# EAGLE design mr_radar_platypus_seeed (EAGLE 5.11)
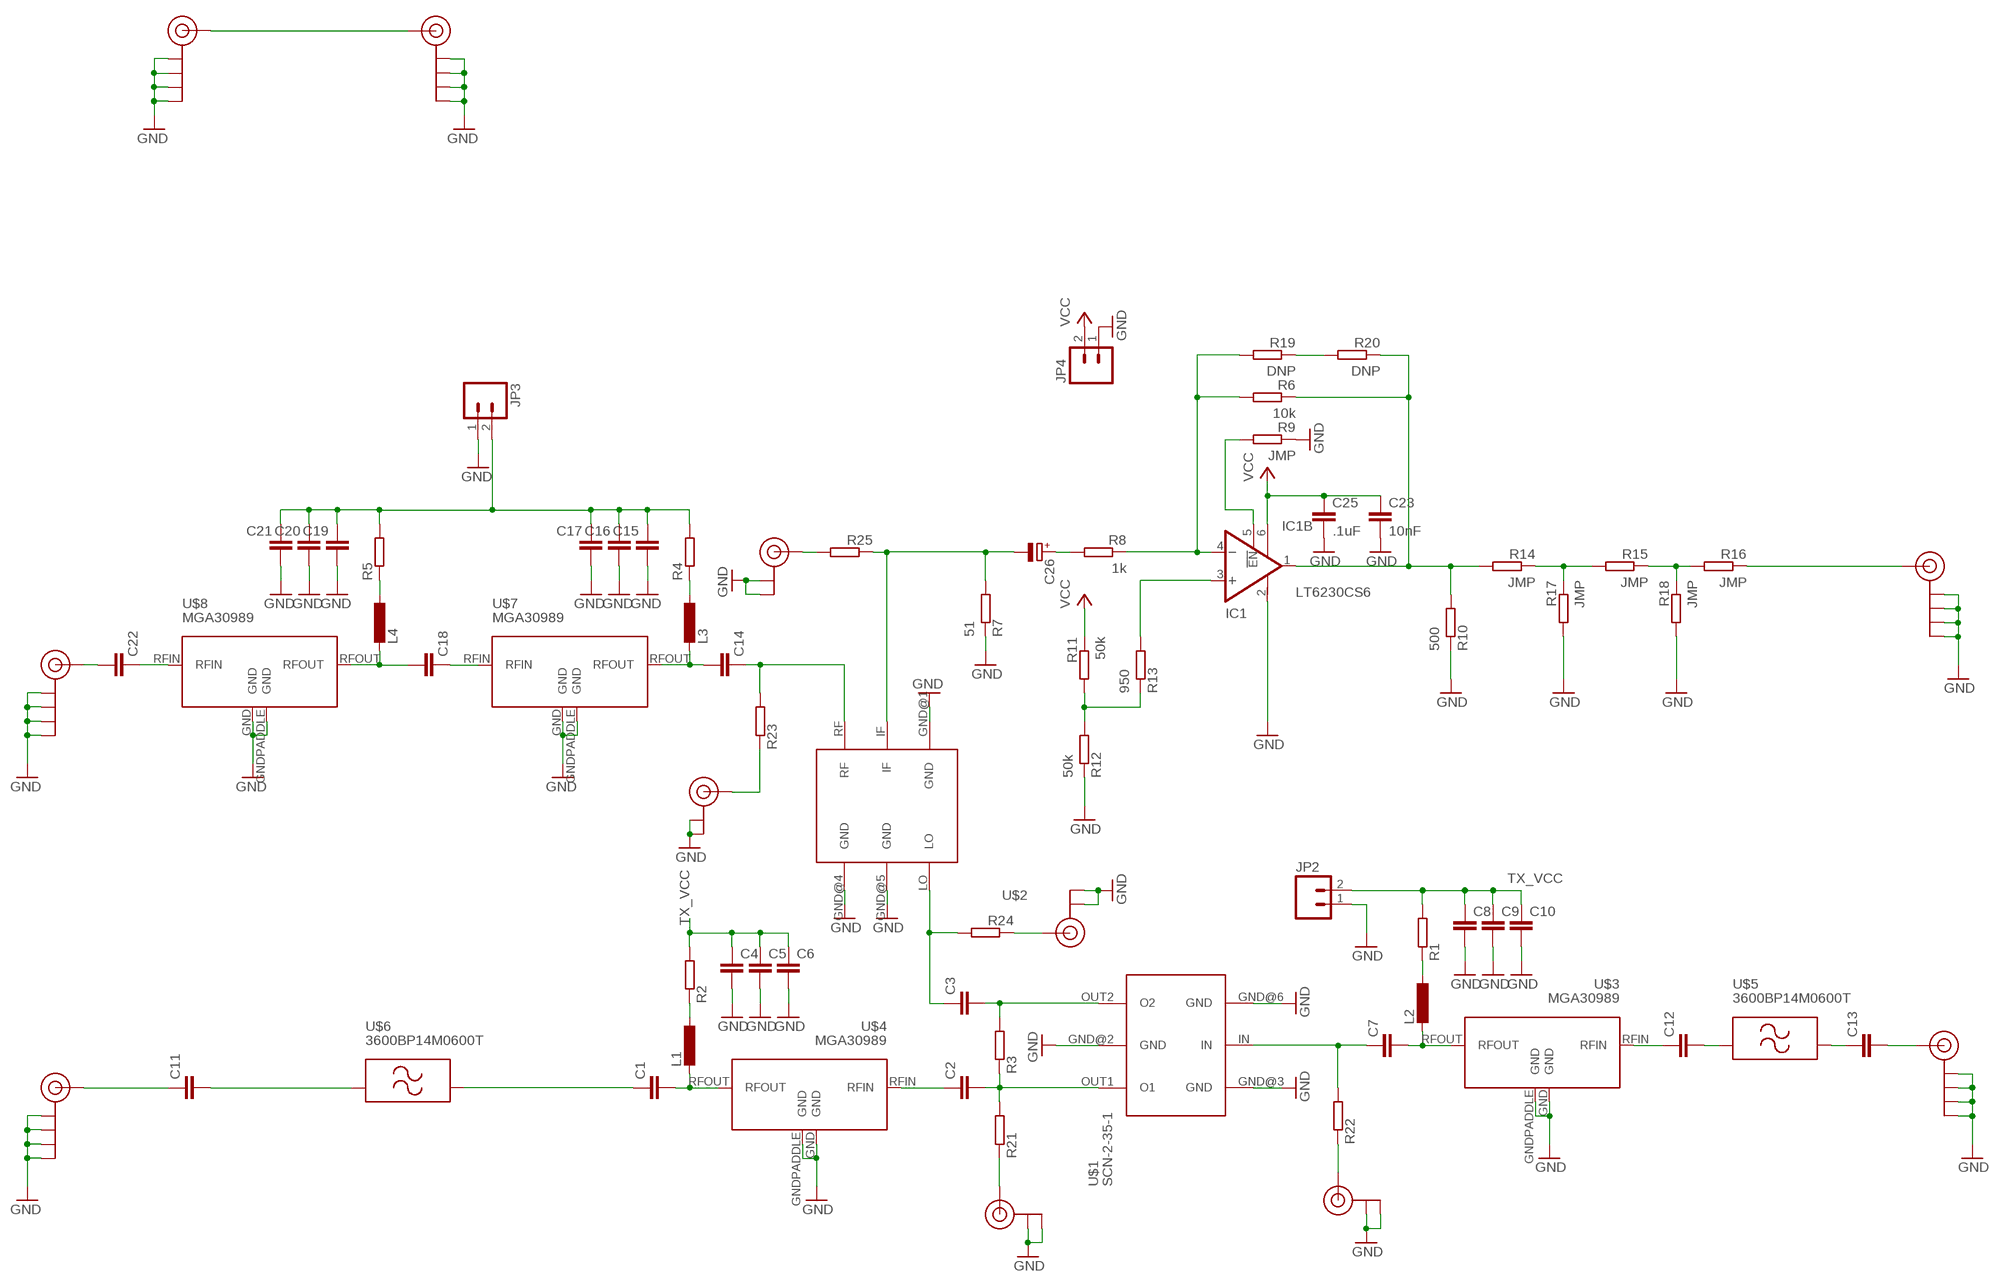
[diagram p0: schematic, sheet 1]

## Parts
C1  CAPACITOR-0402  [0402-CAP]
C2  CAPACITOR-0402  [0402-CAP]
C3  CAPACITOR-0402  [0402-CAP]
C4  CAPACITOR-0603  [0603-CAP]
C5  CAPACITOR-0603  [0603-CAP]
C6  CAPACITOR-0603  [0603-CAP]
C7  CAPACITOR-0402  [0402-CAP]
C8  CAPACITOR-0603  [0603-CAP]
C9  CAPACITOR-0603  [0603-CAP]
C10  CAPACITOR-0603  [0603-CAP]
C11  CAPACITOR-0402  [0402-CAP]
C12  CAPACITOR-0402  [0402-CAP]
C13  CAPACITOR-0402  [0402-CAP]
C14  CAPACITOR-0402  [0402-CAP]
C15  CAPACITOR-0402  [0402-CAP]
C16  CAPACITOR-0402  [0402-CAP]
C17  CAPACITOR-0402  [0402-CAP]
C18  CAPACITOR-0402  [0402-CAP]
C19  CAPACITOR-0402  [0402-CAP]
C20  CAPACITOR-0402  [0402-CAP]
C21  CAPACITOR-0402  [0402-CAP]
C22  CAPACITOR-0402  [0402-CAP]
C23  10nF  CAPACITOR-0603  [0603-CAP]
C25  .1uF  CAPACITOR-0603  [0603-CAP]
C26  CAPACITOR-POLD  [7343/D]
IC1  LT6230CS6  [TSOT23-6]
J$1  SMA_EDGE  [SMA-EDGE]
J$2  SMA_EDGE  [SMA-EDGE]
J$3  SMA_EDGE  [SMA-EDGE]
J$4  SMA_EDGE  [SMA-EDGE]
J$5  SMA_EDGE  [SMA-EDGE]
J$6  SMA_EDGE  [SMA-EDGE]
JP2  M02LOCK_LONGPADS  [1X02_LOCK_LONGPADS]
JP3  M02LOCK_LONGPADS  [1X02_LOCK_LONGPADS]
JP4  M02LOCK_LONGPADS  [1X02_LOCK_LONGPADS]
L1  INDUCTOR-0603  [0603-IND]
L2  INDUCTOR-0603  [0603-IND]
L3  INDUCTOR-0603  [0603-IND]
L4  INDUCTOR-0603  [0603-IND]
R1  RESISTOR-0603  [0603-RES]
R2  RESISTOR-0603  [0603-RES]
R3  RESISTOR-0603  [0603-RES]
R4  RESISTOR-0603  [0603-RES]
R5  RESISTOR-0603  [0603-RES]
R6  10k  RESISTOR-0603  [0603-RES]
R7  51  RESISTOR-0603  [0603-RES]
R8  1k  RESISTOR-0603  [0603-RES]
R9  JMP  RESISTOR-0603  [0603-RES]
R10  500  RESISTOR-0603  [0603-RES]
R11  50k  RESISTOR-0603  [0603-RES]
R12  50k  RESISTOR-0603  [0603-RES]
R13  950  RESISTOR-0603  [0603-RES]
R14  JMP  RESISTOR-0603  [0603-RES]
R15  JMP  RESISTOR-0603  [0603-RES]
R16  JMP  RESISTOR-0603  [0603-RES]
R17  JMP  RESISTOR-0603  [0603-RES]
R18  JMP  RESISTOR-0603  [0603-RES]
R19  DNP  RESISTOR-0603  [0603-RES]
R20  DNP  RESISTOR-0603  [0603-RES]
R21  RESISTOR-0603  [0603-RES]
R22  RESISTOR-0603  [0603-RES]
R23  RESISTOR-0603  [0603-RES]
R24  RESISTOR-0603  [0603-RES]
R25  RESISTOR-0603  [0603-RES]
U$1  SCN-2-35-1  [SCN-2-35-1]
U$2  ADE-30W+  [CD542]
U$3  MGA30989  [SOT89]
U$4  MGA30989  [SOT89]
U$5  3600BP14M0600T  [3600BP14M0600T]
U$6  3600BP14M0600T  [3600BP14M0600T]
U$7  MGA30989  [SOT89]
U$8  MGA30989  [SOT89]
U$9  U.FL  [U.FL]
U$10  U.FL  [U.FL]
U$11  U.FL  [U.FL]
U$12  U.FL  [U.FL]
U$13  U.FL  [U.FL]

## Nets
GND: C4.P$2 C5.P$2 C6.P$2 C8.P$2 C9.P$2 C10.P$2 C15.P$2 C16.P$2 C17.P$2 C19.P$2 C20.P$2 C21.P$2 C23.P$2 C25.P$2 IC1.2(V-) J$1.GND@0(GND) J$1.GND@1(GND) J$1.GND@2(GND) J$1.GND@3(GND) J$2.GND@0(GND) J$2.GND@1(GND) J$2.GND@2(GND) J$2.GND@3(GND) J$3.GND@0(GND) J$3.GND@1(GND) J$3.GND@2(GND) J$3.GND@3(GND) J$4.GND@0(GND) J$4.GND@1(GND) J$4.GND@2(GND) J$4.GND@3(GND) J$5.GND@0(GND) J$5.GND@1(GND) J$5.GND@2(GND) J$5.GND@3(GND) J$6.GND@0(GND) J$6.GND@1(GND) J$6.GND@2(GND) J$6.GND@3(GND) JP2.1 JP3.1 JP4.1 R7.P$1 R9.P$1 R10.P$1 R12.P$1 R17.P$2 R18.P$2 U$1.GND@2(GND) U$1.GND@3(GND) U$1.GND@6(GND) U$2.GND@1(GND) U$2.GND@4(GND) U$2.GND@5(GND) U$3.GND U$3.GNDPADDLE(GND) U$4.GND U$4.GNDPADDLE(GND) U$7.GND U$7.GNDPADDLE(GND) U$8.GND U$8.GNDPADDLE(GND) U$9.P$1(GND) U$9.P$2(GND) U$10.P$1(GND) U$10.P$2(GND) U$11.P$1(GND) U$11.P$2(GND) U$12.P$1(GND) U$12.P$2(GND) U$13.P$1(GND) U$13.P$2(GND)
N$1: C1.P$2 L1.P$2 U$4.RFOUT
N$2: C1.P$1 U$6.P$2
N$3: J$5.SIG(SIGNAL) J$6.SIG(SIGNAL)
N$4: C7.P$2 L2.P$2 U$3.RFOUT
N$5: C7.P$1 R22.P$2 U$1.IN
N$6: C2.P$1 U$4.RFIN
N$7: C2.P$2 R3.P$1 R21.P$2 U$1.OUT1(O1)
N$8: C3.P$2 R3.P$2 U$1.OUT2(O2)
N$10: C11.P$1 J$2.SIG(SIGNAL)
N$11: C11.P$2 U$6.P$1
N$12: C12.P$1 U$3.RFIN
N$13: C12.P$2 U$5.P$1
N$14: C13.P$1 U$5.P$2
N$15: C13.P$2 J$4.SIG(SIGNAL)
N$16: R25.P$2 U$13.P$3(SIGNAL)
N$17: L2.P$1 R1.P$1
N$18: L1.P$1 R2.P$1
N$19: C14.P$1 R23.P$2 U$2.RF
N$20: C14.P$2 L3.P$2 U$7.RFOUT
N$21: C18.P$2 L4.P$2 U$8.RFOUT
N$22: C26.- R7.P$2 R25.P$1 U$2.IF
N$23: C18.P$1 U$7.RFIN
N$24: R23.P$1 U$11.P$3(SIGNAL)
N$25: L3.P$1 R4.P$1
N$26: C15.P$1 C16.P$1 C17.P$1 C19.P$1 C20.P$1 C21.P$1 JP3.2 R4.P$2 R5.P$2
N$27: C22.P$1 U$8.RFIN
N$28: C22.P$2 J$1.SIG(SIGNAL)
N$29: L4.P$1 R5.P$1
N$30: IC1.4(-IN) R6.P$2 R8.P$1 R19.P$2
N$31: IC1.1(OUT) R6.P$1 R10.P$2 R14.P$2 R20.P$1
N$32: R11.P$2 R12.P$2 R13.P$1
N$33: C26.+ R8.P$2
N$34: R14.P$1 R15.P$2 R17.P$1
N$35: IC1.5(!EN) R9.P$2
N$36: R15.P$1 R16.P$2 R18.P$1
N$37: J$3.SIG(SIGNAL) R16.P$1
N$38: IC1.3(+IN) R13.P$2
N$39: R19.P$1 R20.P$2
N$40: R21.P$1 U$9.P$3(SIGNAL)
N$41: R24.P$1 U$12.P$3(SIGNAL)
N$42: R22.P$1 U$10.P$3(SIGNAL)
N$43: C3.P$1 R24.P$2 U$2.LO
TX_VCC: C4.P$1 C5.P$1 C6.P$1 C8.P$1 C9.P$1 C10.P$1 JP2.2 R1.P$2 R2.P$2
VCC: C23.P$1 C25.P$1 IC1.6(V+) JP4.2 R11.P$1

## Power pins joined to a net without a drawn wire
GND: U$5.P$GND0(GND) U$5.P$GND1(GND) U$6.P$GND0(GND) U$6.P$GND1(GND)

## Library data of the parts
C1-C23 C25 = pel_dipol_comp:CAPACITOR
C26 = pel_dipol_comp:CAPACITOR-POL
IC1 = linear-technology:LT6230: 215MHz, Rail-to-Rail Output, 1.1nV/Hz, 3.5mA Op Amp Source: http://cds.linear.com/docs/Datasheet/623012fb.pdf; MPN: LT6230CS6#TR; OC_FARNELL: 1663845; OC_NEWARK: 57M9332
J$1-J$6 = SparkFun:SMA_EDGE: SMA Antenna Connector End launch SMA connector. The paste layer has been removed so that the connector can be hand soldered onto the board after reflow.
JP2-JP4 = SparkFun:M02: Header 2 Standard 2-pin 0.1" header. Use with straight break away headers (SKU : PRT-00116), right angle break away headers (PRT-00553), swiss pins (PRT-00743), machine pins (PRT-00117), and female headers (PRT-00115). Molex polarized connector foot print use with SKU : PRT-08233 with associated crimp pins and housings.
L1-L4 = pel_dipol_comp:INDUCTOR
R1-R25 = pel_dipol_comp:RESISTOR
U$1 = mr_radar:SCN-2-35-1: Power Splitter/Combiner SCN-2-35+ mini-circuits SCN-2-35
U$2 = mr_radar:ADE-30W+
U$3 U$4 U$7 U$8 = mr_radar:MGA30989
U$5 U$6 = mr_radar:3600BP14M0600T
U$9-U$13 = SparkFun:U.FL

## Board
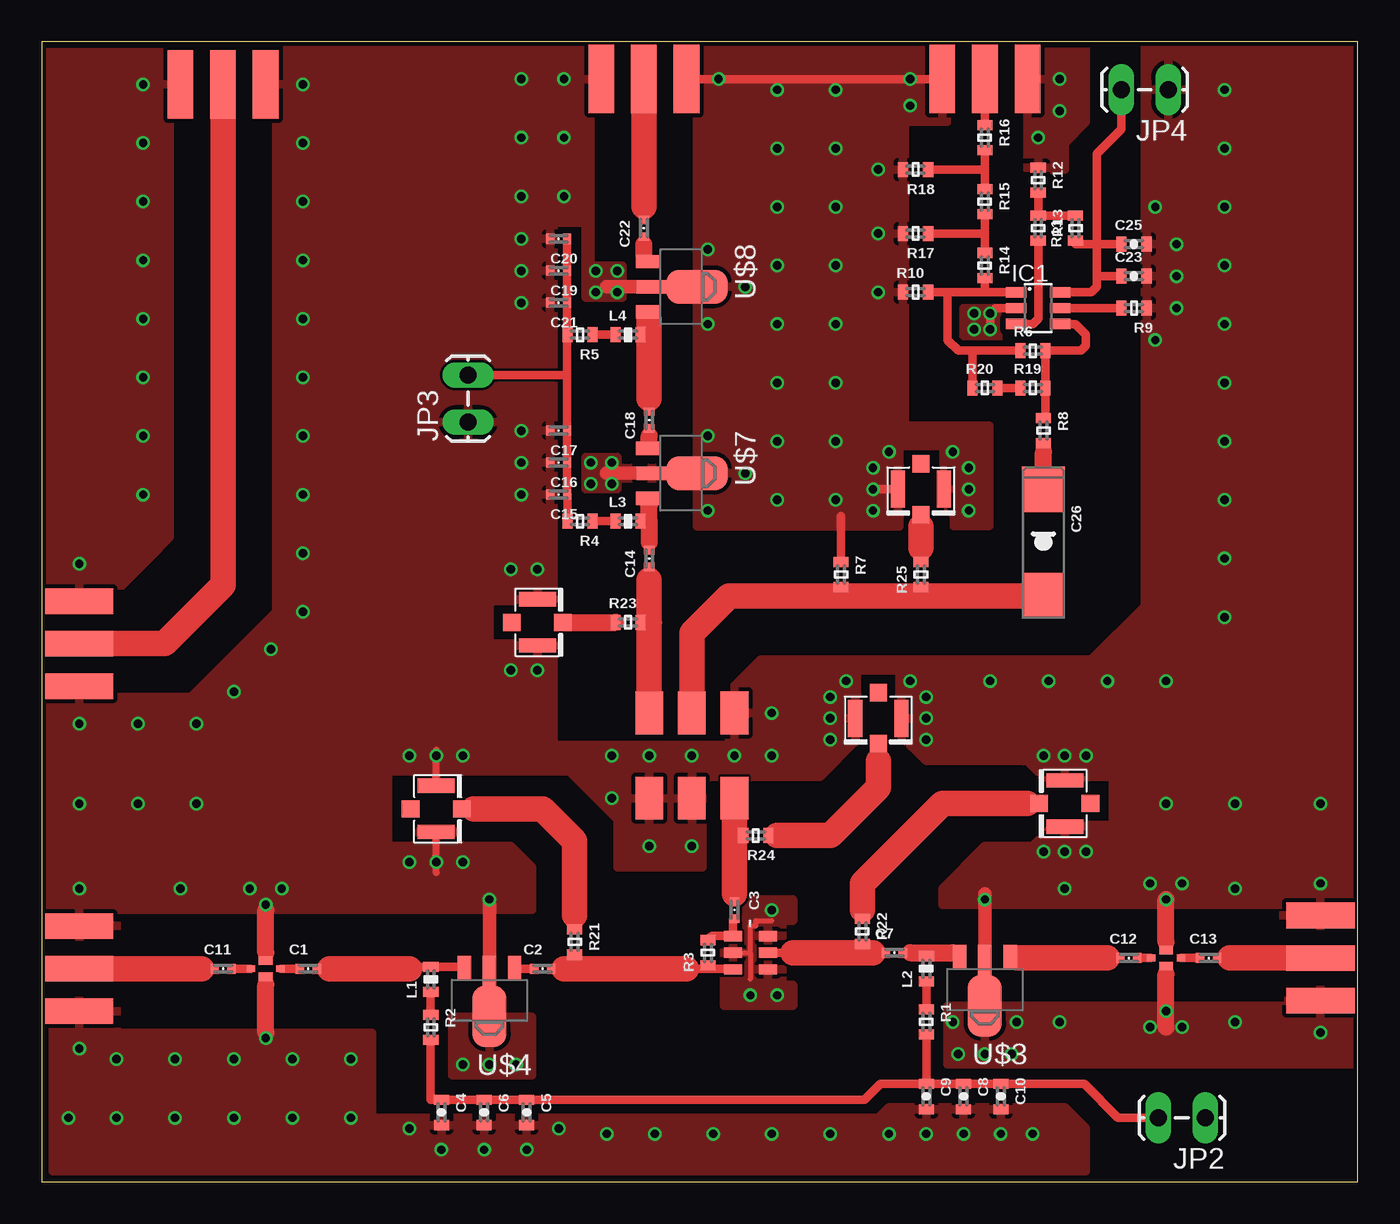
[diagram p1: board, top side]
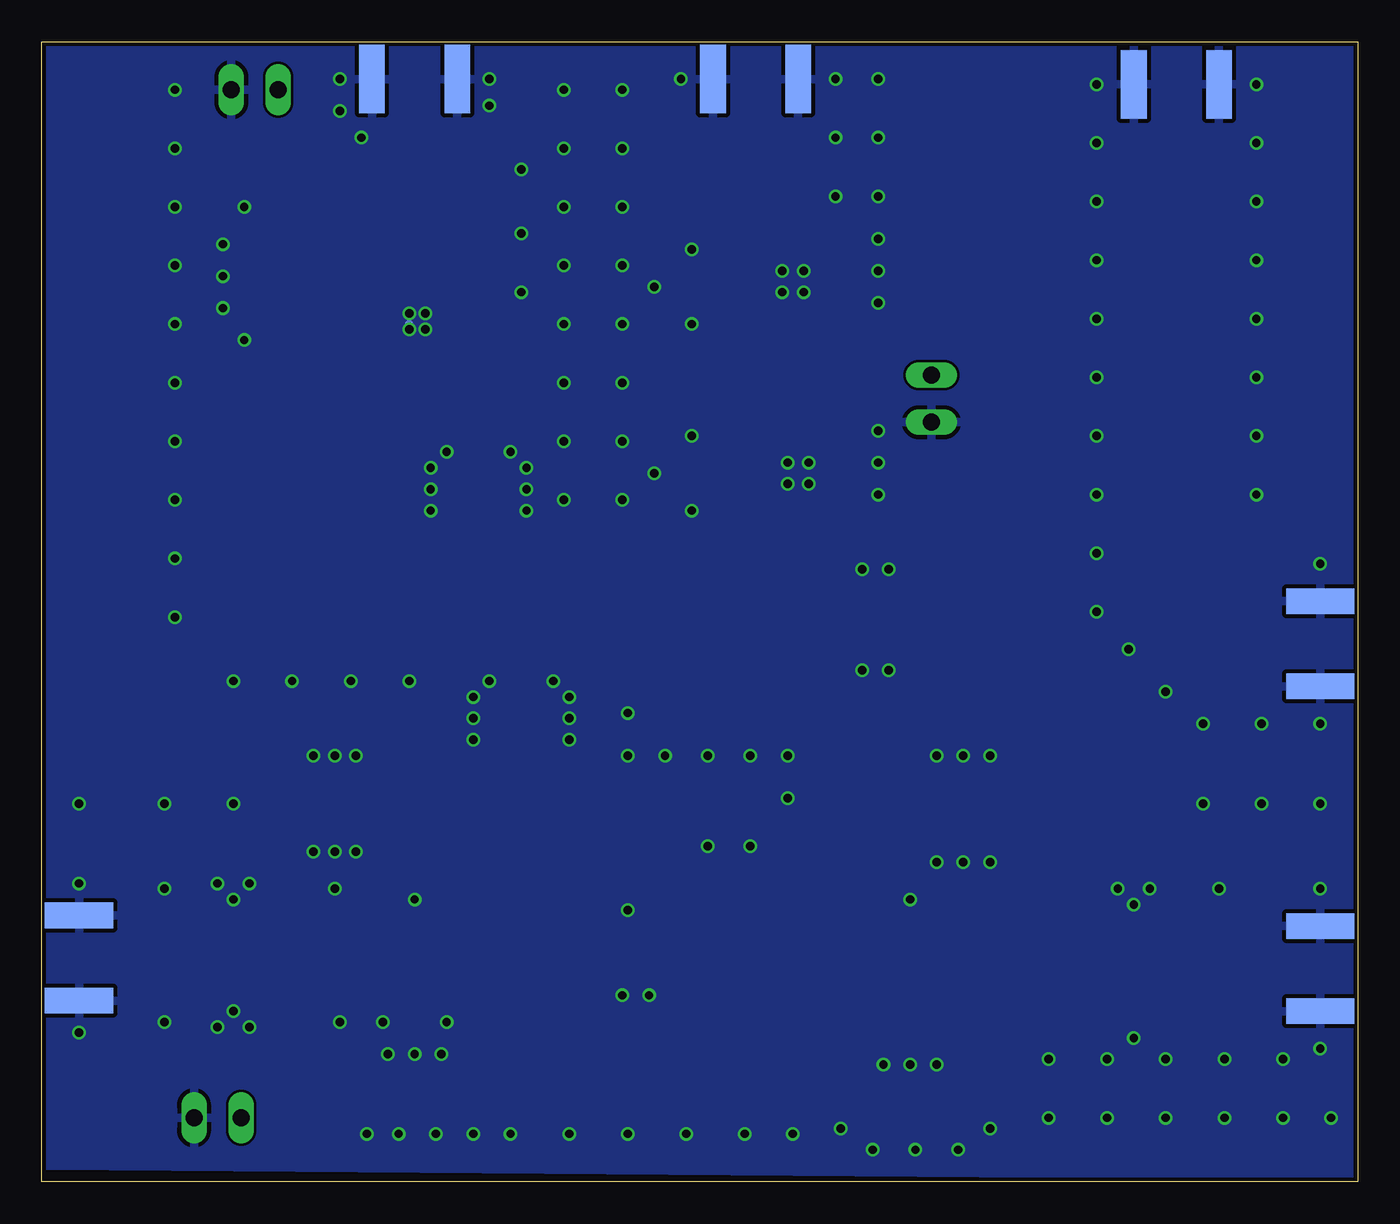
[diagram p2: board, bottom side, seen from below]

Size 78.41 x 67.94 mm. Coordinates in mm from the lower left corner, seen from the top.
Outline: 0,0 78.41,0 78.41,67.94 0,67.94 0,0
Copper layers (1*16): Top 0.035mm / dielectric 1.5mm / Bottom 0.035mm
Design rules "Fusion_eagle_rule_v1.1": minimum track width 6mil, minimum drill 12mil, track to track 6mil, track to pad 6mil, pad to pad 6mil, via to via 6mil, smd to smd 0mil, copper to edge 10mil, drill to drill 10mil, minimum pad ring 10mil, minimum via ring 6mil, stop-mask expansion 2mil, vias tented up to drill 100mil, thermal gap 10mil

### Footprints (pad centres in the part's own frame; a part is rotated, then mirrored left to right if it is on the bottom)
0402-CAP = smd 0.5 x 0.6: P$1 -0.5,0; P$2 0.5,0
0603-CAP = smd 0.6 x 0.9: P$1 -0.75,0; P$2 0.75,0
7343/D = smd 2.7 x 2.55: + -3.175,0; - 3.175,0
TSOT23-6 = smd 0.62 x 1.22: 1 -0.95,-1.3; 2 0,-1.3; 3 0.95,-1.3; 4 0.95,1.3; 5 0,1.3; 6 -0.95,1.3
SMA-EDGE = smd 1.524 x 4.064: GND@0 0,0; GND@1 5.08,0; SIG 2.54,0 | smd 1.524 x 4.064 bottom: GND@2 0,0; GND@3 5.08,0
1X02_LOCK_LONGPADS = drill 1.016 long: 1 -0.127,0; 2 2.667,0
0603-IND = smd 0.6 x 0.9: P$1 -0.75,0; P$2 0.75,0
0603-RES = smd 0.6 x 0.9: P$1 -0.75,0; P$2 0.75,0
SCN-2-35-1 = smd 0.61 x 1.067: GND@2 0,1.041; GND@3 -0.991,-1.041; GND@6 0.991,-1.041; IN 0,-1.041; OUT1 -0.991,1.041; OUT2 0.991,1.041
CD542 = smd 1.651 x 2.54: GND@1 -2.54,-2.54; GND@4 2.54,2.54; GND@5 0,2.54; IF 0,-2.54; LO -2.54,2.54; RF 2.54,-2.54
SOT89 = smd 0.8 x 1.9: GND 0,-1.727 | smd 2.032 x 3.65: GNDPADDLE 0,0.94 | smd 0.8 x 1.4: RFIN -1.499,-1.981; RFOUT 1.499,-1.981
3600BP14M0600T = smd 0.508 x 0.406: P$1 -0.889,0; P$2 0.889,0 | smd 0.813 x 0.508: P$GND0 0,0.483; P$GND1 0,-0.483
U.FL = smd 2.2 x 0.85: P$1 0,1.375; P$2 0,-1.375 | smd 1.05 x 1: P$3 1.525,0; P$4 -1.525,0

### Placement (x,y rotation side)
C1  15.88,12.7 0 top
C2  29.85,12.7 0 top
C3  41.27,16.19 270 top
C4  23.81,4.13 270 top
C5  28.89,4.13 270 top
C6  26.35,4.13 270 top
C7  50.8,13.65 0 top
C8  54.93,5.08 270 top
C9  52.7,5.08 270 top
C10  57.15,5.08 270 top
C11  10.79,12.7 0 top
C12  64.77,13.33 0 top
C13  69.53,13.33 0 top
C14  36.2,37.15 90 top
C15  30.8,40.96 180 top
C16  30.8,42.86 180 top
C17  30.8,44.77 180 top
C18  36.2,45.4 90 top
C19  30.8,54.29 180 top
C20  30.8,56.2 180 top
C21  30.8,52.39 180 top
C22  35.88,56.83 90 top
C23  65.09,53.98 0 top
C25  65.09,55.88 0 top
C26  59.69,38.1 270 top
IC1  59.37,52.07 270 top
J$1  38.42,65.72 180 top
J$2  2.22,15.24 270 top
J$3  58.74,65.72 180 top
J$4  76.2,10.79 90 top
J$5  2.22,29.53 90 top
J$6  8.26,65.41 0 top
JP2  69.22,3.81 180 top
JP3  25.4,45.4 90 top
JP4  66.99,65.09 180 top
L1  23.18,12.06 90 top
L2  52.7,12.7 90 top
L3  34.92,39.37 0 top
L4  34.92,50.48 0 top
R1  52.7,9.53 270 top
R2  23.18,9.21 270 top
R3  39.69,13.65 90 top
R4  32.07,39.37 180 top
R5  32.07,50.48 180 top
R6  59.05,49.53 0 top
R7  47.62,36.2 270 top
R8  59.69,44.77 270 top
R9  65.09,52.07 180 top
R10  52.07,53.02 0 top
R11  61.59,56.83 90 top
R12  59.37,59.69 270 top
R13  59.37,56.83 270 top
R14  56.2,54.61 270 top
R15  56.2,58.42 270 top
R16  56.2,62.23 270 top
R17  52.07,56.52 180 top
R18  52.07,60.33 180 top
R19  59.05,47.31 0 top
R20  56.2,47.31 0 top
R21  31.75,14.29 270 top
R22  48.89,14.92 270 top
R23  34.92,33.34 0 top
R24  42.54,20.64 180 top
R25  52.39,36.2 90 top
U$1  42.23,13.65 90 top
U$2  38.73,25.4 180 top
U$3  56.2,11.43 180 top
U$4  26.67,10.79 180 top
U$5  66.99,13.33 0 top
U$6  13.33,12.7 0 top
U$7  38.1,42.23 270 top
U$8  38.1,53.34 270 top
U$9  23.5,22.23 0 top
U$10  60.96,22.54 180 top
U$11  29.53,33.34 0 top
U$12  49.85,27.62 270 top
U$13  52.39,41.27 270 top

### Tracks (layer width: path | path; a pad name or v marks a point on that pad's centre or on a via)
GND  (via drill 0.5)
  Top 0.305: U$1.GND@2 42.23,13.65 | 42.23,13.65 42.23,12.06 | 42.23,13.65 42.23,15.24 42.54,15.24 42.54,15.56 43.5,15.56 | U$4.GNDPADDLE U$4.GND
  Top 0.406: 23.5,18.42 U$9.P$2 | U$9.P$1 23.5,25.72
  Top 0.508: IC1.2 56.83,52.07 v56.52,51.75 56.52,51.12 | R7.P$1 47.62,39.69 | U$13.P$2 49.85,41.27 | U$5.P$GND0 66.99,14.29 | 66.99,12.38 U$5.P$GND1 | 13.33,11.75 U$6.P$GND1 | J$1.GND@2 J$3.GND@3 | U$6.P$GND0 13.33,13.65
  Top 0.61: 13.33,13.65 13.33,13.33
  Top 0.813: U$4.GND 26.67,16.51 | U$3.GND 56.2,17.14 | 33.66,53.34 U$8.GND | 33.66,42.23 U$7.GND
  Top 1.016: 13.33,13.65 13.33,16.19 | 66.99,14.29 v66.99,16.83 | 66.99,9.21 66.99,12.38 | 13.33,8.89 13.33,11.75
  Bottom 0.508: v56.52,50.8 56.52,51.12
  other vias: 13.33,16.51 13.33,8.57 56.2,16.83 66.99,10.16 43.5,16.19 43.81,11.11 42.23,11.11 55.56,50.8 55.56,51.75 34.29,54.29 34.29,53.02 33.02,53.02 33.02,54.29 33.97,42.86 33.97,41.59 32.7,42.86 32.7,41.59 55.24,42.55 55.24,41.27 55.24,40.01 54.29,43.5 49.53,42.55 49.53,41.27 49.53,40.01 50.48,43.5 46.99,27.62 46.99,26.35 46.99,28.89 52.7,28.89 52.7,27.62 52.7,26.35 51.75,29.85 47.94,29.85 60.96,25.4 59.69,25.4 62.23,25.4 59.69,19.69 60.96,19.69 62.23,19.69 52.7,2.86 54.93,2.86 57.15,2.86 59.05,2.86 50.48,2.86 25.08,6.99 26.67,6.99 28.26,6.99 26.67,16.83 36.2,25.4 38.73,25.4 41.27,25.4 43.5,25.4 33.97,25.4 38.73,20 36.2,20 43.5,27.94 33.97,22.86 59.37,62.23 51.75,64.13 51.75,65.72 49.85,60.33 49.85,56.52 49.85,53.02 60.64,65.72 60.64,63.82 40.32,65.72 39.69,55.56 41.91,53.34 39.69,51.12 41.91,42.23 39.69,44.45 39.69,40.01 28.89,1.91 26.35,1.91 23.81,1.91 30.8,3.17 21.91,3.17 28.58,56.2 28.58,54.29 28.58,52.39 31.12,65.72 15.56,65.41 2.22,36.83 2.22,27.3 2.22,17.46 2.22,7.94 76.2,17.78 76.2,8.89 29.53,30.48 27.94,30.48 29.53,36.51 27.94,36.51 23.5,25.4 25.08,25.4 21.91,25.4 23.5,19.05 25.08,19.05 21.91,19.05 28.58,44.77 28.58,42.86 28.58,40.96 67.63,55.88 67.63,53.98 67.63,52.07 66.36,50.16 66.36,58.1 54.61,7.62 56.2,7.62 57.78,7.62 58.1,9.53 54.29,9.53 11.43,7.3 14.92,7.3 11.43,3.81 14.92,3.81 18.42,7.3 18.42,3.81 4.45,7.3 7.94,7.3 4.45,3.81 7.94,3.81 1.59,3.81 43.5,2.86 46.99,2.86 36.51,2.86 40,2.86 33.66,2.86 6.03,58.42 6.03,61.91 6.03,65.41 6.03,51.44 6.03,54.93 6.03,47.94 6.03,44.45 6.03,40.96 15.56,58.42 15.56,61.91 15.56,51.44 15.56,54.93 15.56,47.94 15.56,44.45 15.56,40.96 15.56,37.47 15.56,33.97 13.65,31.75 5.71,27.3 9.21,27.3 11.43,29.21 56.52,29.85 63.5,29.85 60.01,29.85 66.99,29.85 70.48,65.09 70.48,58.1 70.48,61.59 70.48,51.12 70.48,54.61 70.48,47.62 70.48,44.13 70.48,40.64 70.48,37.15 70.48,33.66 2.22,22.54 5.71,22.54 9.21,22.54 43.81,65.09 43.81,58.1 43.81,61.59 43.81,51.12 43.81,54.61 43.81,47.62 43.81,44.13 43.81,40.64 47.31,65.09 47.31,58.1 47.31,61.59 47.31,51.12 47.31,54.61 47.31,47.62 47.31,44.13 47.31,40.64 60.96,17.46 71.12,17.46 71.12,9.53 60.64,9.53 28.58,65.72 28.58,58.74 28.58,62.23 66.99,22.54 71.12,22.54 76.2,22.54 66.04,9.21 67.95,9.21 67.95,17.78 66.04,17.78 14.29,17.46 12.38,17.46 8.26,17.46 31.12,62.23 31.12,58.74
  pour Bottom: 78.11,67.63 78.11,0.95 0.32,0.32 0.32,67.63
  pour Top: 51.12,45.09 51.43,45.4 51.43,63.18 53.98,63.18 53.98,67.63 51.12,67.63
  pour Top (isolate 0.356): 54.93,50.16 57.15,50.16 57.15,52.07 54.93,52.07
  pour Top (isolate 0.356): 58.74,60.33 60.96,60.33 60.96,61.91 62.23,63.18 62.23,67.63 58.74,67.31
  pour Top: 39.05,67.63 39.05,39.05 51.12,39.05 51.12,67.63
  pour Top: 34.29,18.73 39.37,18.73 39.37,24.13 46.35,24.13 48.58,26.35 48.58,30.48 51.12,30.48 51.12,26.67 52.7,25.08 58.74,25.08 59.69,24.13 63.82,24.13 63.82,21.27 60.32,21.27 59.05,20 56.2,20 53.66,17.46 53.66,16.51 73.98,16.51 73.98,15.24 78.11,15.24 78.11,67.63 65.72,67.63 65.72,34.29 62.55,31.12 42.86,31.12 40.96,29.21 40.96,26.04 34.29,26.04
  pour Top: 0.32,14.6 4.45,14.6 4.45,16.19 29.21,16.19 29.21,18.73 27.94,20 25.08,20 24.77,20.32 24.77,20.96 22.54,20.96 22.54,20.32 22.23,20 0.32,20
  pour Top: 13.97,20 20.64,20 20.64,24.45 22.23,24.45 22.54,24.13 24.45,24.13 24.77,24.45 31.43,24.45 34.29,21.59 34.29,26.04 30.48,26.04 30.48,32.07 26.67,32.07 26.67,34.61 30.48,34.61 30.48,67.63 13.97,67.63
  pour Top: 30.16,57.15 32.38,57.15 32.7,57.15 32.7,67.63 30.48,67.63
  pour Top: 53.66,42.55 54.29,42.23 53.98,42.23 53.98,40.01 54.29,39.69 54.29,39.05 56.52,39.05 56.52,45.09 50.8,45.09 50.48,45.4 50.48,43.81 53.66,43.81
  pour Top: 32.38,57.15 32.38,52.7 34.61,52.7 34.61,54.61 32.7,54.61 32.7,57.15
  pour Top: 39.05,44.13 39.05,42.55 34.29,42.55 34.29,43.18 32.38,43.18 32.38,41.27 34.29,41.27 34.29,41.91 40.32,41.91 40.32,44.13
  pour Top: 39.05,16.83 44.77,16.83 44.77,15.56 44.13,15.56 44.13,11.75 44.77,11.75 44.77,10.48 40.64,10.48 40.64,15.24 38.73,15.24 38.73,18.42 39.05,18.42
  pour Top: 29.21,9.84 24.45,9.84 24.45,6.35 29.21,6.35
  pour Top: 58.74,10.48 58.74,6.99 53.98,6.99 53.98,10.48
  pour Top: 58.74,6.99 58.74,10.48 74.3,10.48 74.3,11.43 78.11,11.43 78.11,6.99
  pour Top: 4.45,8.89 4.45,10.79 0.64,10.79 0.64,0.64 62.23,0.64 62.23,3.17 60.96,4.45 50.48,4.45 49.85,3.81 19.69,3.81 19.69,8.89
  pour Top: 0.32,35.24 4.45,35.24 6.35,37.15 7.62,38.42 7.62,67.31 0.32,67.31
  pour Top: 0.32,28.89 8.89,28.89 13.97,33.97 13.97,36.51 18.1,36.51 18.1,20.64 17.46,20 0.32,20
N$1
  Top 0.406: 22.02,12.81 20.32,12.81 20.32,12.7
  Top 0.508: U$4.RFOUT 25.13,12.81 L1.P$2 22.02,12.81 | C1.P$2 17.15,12.7
  Top 1.524: 17.15,12.7 20.32,12.7 21.91,12.7
N$2
  Top 0.508: U$6.P$2 C1.P$1
N$3
  Top 1.524: J$5.SIG 7.3,32.07 10.79,35.56 J$6.SIG
N$4
  Top 0.508: 54.66,13.45 U$3.RFOUT 54.46,13.65 54.29,13.65 | C7.P$2 51.75,13.65 52.5,13.65 L2.P$2
  Top 1.016: 51.75,13.65 54.29,13.65
N$5
  Top 0.508: 49.53,13.65 C7.P$1 | U$1.IN 44.77,13.65 | 48.89,13.65 R22.P$2
  Top 1.524: 44.77,13.65 48.89,13.65 49.53,13.65
N$6
  Top 0.508: U$4.RFIN 28.25,12.7 C2.P$1
N$7
  Top 0.508: U$1.OUT1 arc90 41.15,12.7 39.48,12.7 | C2.P$2 31.12,12.7 | 31.75,12.7 R21.P$2 | 39.48,12.7 R3.P$1 | 38.42,12.7 39.48,12.7
  Top 1.524: 31.12,12.7 31.75,12.7 38.42,12.7
N$8
  Top 0.508: C3.P$2 41.19,15.6 U$1.OUT2 39.93,14.64 R3.P$2
N$10
  Top 0.508: 9.53,12.7 C11.P$1
  Top 1.524: J$2.SIG 9.53,12.7
N$11
  Top 0.508: U$6.P$1 C11.P$2
N$12
  Top 0.508: U$3.RFIN 57.77,13.33 58.1,13.33 | 63.5,13.33 C12.P$1
  Top 1.524: 58.1,13.33 63.5,13.33
N$13
  Top 0.508: U$5.P$1 C12.P$2
N$14
  Top 0.508: C13.P$1 U$5.P$2
N$15
  Top 0.508: C13.P$2 70.8,13.33
  Top 1.524: 70.8,13.33 J$4.SIG
N$16
  Top 0.508: R25.P$2 52.39,37.78 | 52.39,39.05 U$13.P$3
  Top 1.524: 52.39,37.78 52.39,39.05
N$17
  Top 0.508: L2.P$1 R1.P$1
N$18
  Top 0.508: L1.P$1 R2.P$1
N$19
  Top 0.508: 36.2,35.88 C14.P$1 | R23.P$2 36.2,33.34 36.71,33.34
  Top 1.524: 36.2,35.88 36.2,33.34 U$2.RF
N$20
  Top 0.508: 36.2,38.1 C14.P$2 | 36.2,40.32 36.2,40.73 U$7.RFOUT | L3.P$2 36.2,39.37
  Top 1.016: 36.2,38.1 36.2,39.37 36.2,40.32
N$21
  Top 0.508: U$8.RFOUT 36.2,51.84 36.2,51.44 | C18.P$2 36.2,46.67 | 36.2,50.48 L4.P$2
  Top 1.524: 36.2,46.67 36.2,50.48 36.2,51.44
N$22
  Top 0.508: R7.P$2 47.94,35.45 47.94,34.93 | 52.39,34.93 R25.P$1
  Top 1.524: C26.- 52.39,34.93 47.94,34.93 40.96,34.93 38.73,32.7 U$2.IF
N$23
  Top 0.508: U$7.RFIN arc-90 36.2,43.97 | 36.2,44.45 C18.P$1
  Top 1.016: 36.2,43.97 36.2,44.45
N$24
  Top 1.016: U$11.P$3 R23.P$1
N$25
  Top 0.508: R4.P$1 L3.P$1
N$26
  Top 0.508: R4.P$2 31.32,40.96 C15.P$1 C16.P$1 C17.P$1 31.3,48.07 | C20.P$1 C19.P$1 C21.P$1 31.3,50.5 R5.P$2 31.3,50.48 31.3,48.58 31.3,48.07 | 31.3,48.07 JP3.2
N$27
  Top 0.508: U$8.RFIN 35.88,54.84 35.88,55.25 | 35.88,55.88 C22.P$1
  Top 1.016: 35.88,55.25 35.88,55.88
N$28
  Top 0.508: C22.P$2 35.88,58.1
  Top 1.524: 35.88,58.1 J$1.SIG
N$29
  Top 0.508: R5.P$1 L4.P$1
N$30
  Top 0.508: IC1.4 61.59,51.12 62.23,50.48 62.23,49.85 61.91,49.53 R6.P$2 R19.P$2 59.8,45.52 R8.P$1
N$31
  Top 0.508: R20.P$1 55.45,49.53 R6.P$1 54.61,49.53 53.98,50.16 53.98,53.02 | 56.2,53.02 55.88,53.02 53.98,53.02 | 56.2,53.02 IC1.1 | 56.2,53.02 R14.P$2 | 53.98,53.02 R10.P$2
N$32
  Top 0.508: R12.P$2 R13.P$1 R11.P$2
N$33
  Top 0.508: 59.69,43.5 R8.P$2
  Top 1.016: C26.+ 59.69,43.5
N$34
  Top 0.508: 56.2,56.52 R14.P$1 | 56.2,56.52 R15.P$2 | R17.P$1 56.2,56.52
N$35
  Top 0.508: IC1.5 R9.P$2
N$36
  Top 0.508: 56.2,60.33 R15.P$1 | 56.2,60.33 R16.P$2 | R18.P$1 56.2,60.33
N$37
  Top 0.508: R16.P$1 J$3.SIG
N$38
  Top 0.508: IC1.3 59.05,51.12 59.37,51.44 R13.P$2
N$39
  Top 0.508: R20.P$2 R19.P$1
N$40
  Top 0.406: R21.P$1 31.75,15.88
  Top 0.508: 25.72,22.23 U$9.P$3
  Top 1.524: 31.75,15.88 31.75,20.32 29.85,22.23 25.72,22.23
N$41
  Top 0.508: R24.P$1 43.81,20.64 | 49.85,25.08 U$12.P$3
  Top 1.524: 43.81,20.64 46.99,20.64 49.85,23.5 49.85,25.08
N$42
  Top 0.508: R22.P$1 48.89,16.19 | 58.74,22.54 U$10.P$3
  Top 1.524: 48.89,16.19 48.89,17.78 53.66,22.54 58.74,22.54
N$43
  Top 0.508: C3.P$1 41.27,17.14 | 41.27,20.64 R24.P$2
  Top 1.524: 41.27,17.14 41.27,20.64 U$2.LO
TX_VCC
  Top 0.508: R2.P$2 23.18,4.88 C4.P$1 C6.P$1 C5.P$1 49.01,4.88 49.96,5.83 C9.P$1 | C9.P$1 C8.P$1 C10.P$1 62.11,5.83 64.14,3.81 JP2.2 | C9.P$1 R1.P$2
VCC
  Top 0.508: 62.86,55.88 C25.P$1 | JP4.2 64.33,62.74 62.86,61.28 62.86,55.88 | IC1.6 62.54,53.02 62.86,53.34 62.86,53.98 | 62.86,53.98 62.86,55.88 | 62.86,53.98 C23.P$1 | R11.P$1 61.59,55.88 62.86,55.88